# Altium project TG102LE_4G_A7682_240822.PrjPcb
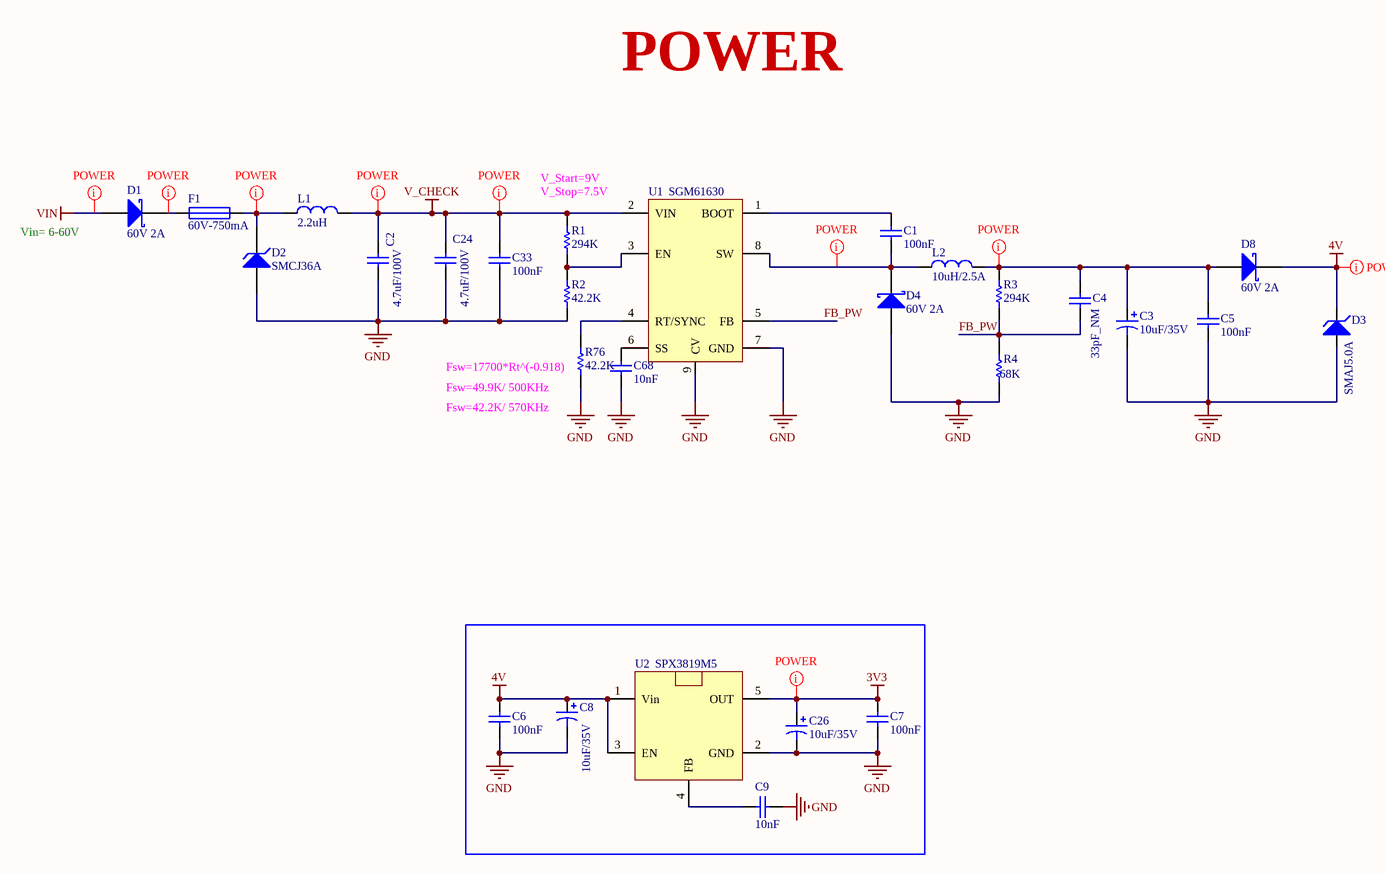
[diagram p0: 03 Power DC.SchDoc]
GlobalProjectName: TG102LE-4G
2 sheets, 34 parts. Net scope: flat (ports and power ports of the same name join across sheets).
Board file: TG102LE4G_A7682_240822.PcbDoc
Sheets:
  03 Power DC.SchDoc
  08 Motion.SchDoc

## Sheet 03 Power DC.SchDoc
size B

### Parts
C1  100nF  [0603 - C]
C2  4.7uF/100V  [1210 - C]
C3  10uF/35V  [CAP_ALUM_SMD_5054_TYPE_C]
C4  33pF_NM  [0603 - C]
C5  100nF  [0603 - C]
C6  100nF  [0603 - C]
C7  100nF  [0603 - C]
C8  10uF/35V  [CAP_ALUM_SMD_5054_TYPE_C]
C9  10nF  [0603 - C]
C24  4.7uF/100V  [1210 - C]
C26  10uF/35V  [CAP_ALUM_SMD_5054_TYPE_C]
C33  100nF  [0603 - C]
C68  10nF  [0603 - C]
D1  60V 2A  [SOD-123]
D2  SMCJ36A  [DIODE - SMC]
D3  SMAJ5.0A  [Diode - SMA]
D4  60V 2A  [SOD-123]
D8  60V 2A  [SOD-123]
F1  60V-750mA  [2016 - Fuse]
L1  2.2uH  [1210 - L]
L2  10uH/2.5A  [INDUCTOR-5D28]
R1  294K  [0603 - R]
R2  42.2K  [0603 - R]
R3  294K  [0603 - R]
R4  68K  [0603 - R]
R76  value 42.2K  [0603 - R]  (hidden comment: 49.9K)
U1  SGM61630  [SOIC8 - POWER]
U2  SPX3819M5  [SOT23-5]

### Nets
3V3: C7.2 C26.1 U2.5(OUT)
4V: C6.2 C8.1 D3.2(K) D8.2(K) U2.1(Vin) U2.3(EN)
GND: C2.1 C3.2 C5.1 C6.1 C7.1 C8.2 C9.2 C24.1 C26.2 C33.1 C68.1 D2.1(A) D3.1(A) D4.1(A) R2.1 R4.1 R76.1 U1.7(GND) U1.9(CV) U2.2(GND)
V_CHECK: C2.2 C24.2 C33.2 L1.2 R1.2 U1.2(VIN)
VIN: D1.1(A)
FB_PW: C4.1 R3.1 R4.2 U1.5(FB)
NetC1_1: C1.1 U1.1(BOOT)
NetC1_2: C1.2 D4.2(K) L2.1 U1.8(SW)
NetC3_1: C3.1 C4.2 C5.2 D8.1(A) L2.2 R3.2
NetC9_1: C9.1 U2.4(NC)
NetC68_2: C68.2 U1.6(SS)
NetD1_2: D1.2(K) F1.1
NetD2_2: D2.2(K) F1.2 L1.1
NetR1_1: R1.1 R2.2 U1.3(EN)
NetR76_2: R76.2 U1.4(RT/SYNC)

### Layout directives
net class POWER: 3V3, 4V, NetC1_2, NetC3_1, NetD1_2, NetD2_2, V_CHECK, VIN

### Notes on the sheet
- POWER
- (near D1) Vin= 6-60V
- V_Start=9V
- V_Stop=7.5V
- (near R76) Fsw=17700*Rt^(-0.918)
- (near R76) Fsw=49.9K/ 500KHz
- (near R76) Fsw=42.2K/ 570KHz

### Library data of the parts
C1 C5-C7 C33 = Cap 0603 100nF: CAP CER 100nF 50V C0G/NP0 0603 ±5%; MPN: CL10C104JB8NNNC; MFR: SAMSUNG; Company ID: VT_CAP_C0603 100nF; Voltage: 50V; Package: 0603; Value: 100nF; Size: C0603: 100nF
C2 C24 = Cap 1210 4.7uF: CAP CER 4.7UF 100V X5R 1210; MFR: Taiyo Yuden; MPN: HMK325BJ475KM-PE; Company ID: VT_CAP_C1210 4.7uF 100V; Size: C1210: 4.7uF/100V; Value: 4.7uF/100V
C3 = Cap Alu 10uF/35V: CAP ALUM 100UF 20% 6.3V SMD 5x5.4mm; MPN: UWT1V100MCL1GB; MFR: Nichicon; Company ID: VT_CAP_ALU 10uF 35V; Value: 10uF/35V
C4 = Cap 0603 33pF: CAP CER 33PF 50V C0G 0603; MFR: Yageo; MPN: AC0603FRNPO9BN330; Company ID: VT_CAP_C0603 33pF; Size: C0603: 33pF; Value: 33pF_NM
C8 C26 = Cap Alu 10uF/35V: CAP ALUM 10UF 20% 35V SMD 5x5.4mm; MPN: UWT1V100MCL1GB; MFR: Nichicon; Company ID: VT_CAP_ALU 10uF 35V; Value: 10uF/35V
C9 C68 = Cap 0603 10nF: CAP CER 10nF 50V C0G/NP0 0603; MPN: CL10C103JB8NNNC; MFR: SAMSUNG; Company ID: VT_CAP_C0603 10nF; Size: C0603: 10nF; Value: 10nF
D1 D4 D8 = Diode PMEG6020ER: DIODE SCHOTTKY 60V 2A SOD123W; MPN: PMEG6020ER,115; MFR: NXP; Company ID: VT_DIODE_PMEG6020ER
D2 = Diode SMCJ36A: TVS DIODE 36V 58.1V DO214AB; MFR: Vishay; MPN: SMCJ36A-E3/9AT; Company ID: VT_DIODE_ SMCJ36
D3 = Diode SMAJ5.0A: TVS DIODE 5VWM 9.2VC SMA; MFR: Littelfuse Inc.; Company ID: VT_DIODE_ SMAJ5.0A; MPN: SMAJ5.0A
F1 = Fuse 60V - 750mA: PTC RESET FUSE 60V 750MA 2016; MFR: Littelfuse Inc.; MPN: 2016L075/60MR; Company ID: VT_Fuse_60V - 750mA
L1 = Inductor 3225 2.2uH: FIXED IND 2.2UH 1.6A 76 MOHM SMD; MPN: LQH32PN2R2NN0; MFR: Murata; Company ID: VT_IND_3225 2.2uH; Value: 2.2uH; Size: L3225: 2.2uH; MPN2: SWPA3015S2R2NT
L2 = Inductor 10uH 2.5A: FIXED IND 10UH 2.5A 61.1MOHM SMD; MFR: Taiyo Yuden; MPN: NR6045T100M; Company ID: VT_IND_10uH/2.5A
R1 R3 = Res 0603 294K: RES SMD 294K OHM 1% 1/10W 0603; MFR: Yageo; MPN: RC0603FR-07294KL; Company ID: VT_RES_R0603 294K; Value: 294K
R2 R76 = Res 0603 42.2K: RES SMD 42K2 OHM 1% 1/10W 0603; MFR: Yageo; MPN: RC0603FR-0742K2L; Company ID: VT_RES_R0603 42K2; Size: R0603: 42K2
  R2: Value: 42.2K
R4 = Res 0603 68K: RES SMD 68K OHM 1% 1/10W 0603; MFR: Yageo; MPN: RC0603FR-0768KL; Company ID: VT_RES_R0603 68K; Size: R0603: 68K; Value: 68K
U1 = SGM61630: MPN: SGM61630AXPS8G/TR; MFR: SGMICRO; Company ID: VT_IC_SGM61630
U2 = SPX3819M5-L-3-3/TR: IC REG LINEAR 3.3V 500MA SOT23-5; MFR: MaxLinear; Company ID: VT_IC_SPX3819; MPN: SPX3819M5-L-3-3/TR

## Sheet 08 Motion.SchDoc
size A
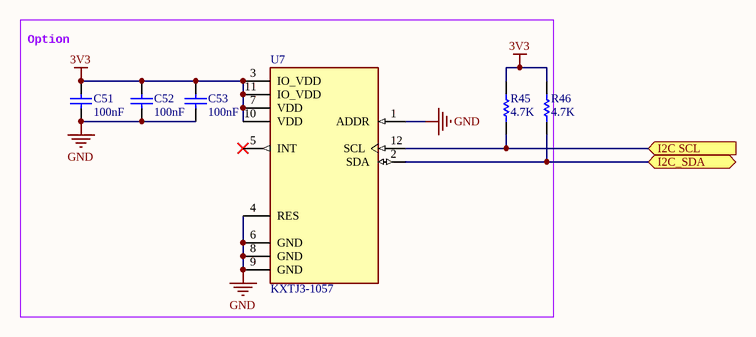
[diagram p1: 08 Motion.SchDoc]

### Parts
C51  100nF  [0603 - C]
C52  100nF  [0603 - C]
C53  100nF  [0603 - C]
R45  4.7K  [0603 - R]
R46  4.7K  [0603 - R]
U7  KXTJ3-1057  [KXTJ3-1057]

### Blocks framed on the sheet
Option: C51-C53 R45 R46 U7

### Ports
I2C SCL (in), I2C_SDA (bidir)

### Nets
3V3: C51.2 C52.2 C53.2 R45.2 R46.2 U7.3(IO_VDD) U7.7(VDD) U7.10(VDD) U7.11(IO_VDD)
GND: C51.1 C52.1 C53.1 U7.1(ADDR) U7.4(RES) U7.6(GND) U7.8(GND) U7.9(GND)
NetR45_1: R45.1 U7.12(SCL) ; port I2C SCL
NetR46_1: R46.1 U7.2(SDA) ; port I2C_SDA

Not connected (* = marked no-connect by the designer): U7 5(INT)*

### Library data of the parts
C51-C53 = Cap 0603 100nF: as C1 on sheet 03 Power DC; Voltage: 50V; Package: 0603; Size: C0603: 100nF; Value: 100nF
R45 R46 = Res 0603 4.7K: RES SMD 4.7K OHM 1% 1/10W 0603; MFR: Yageo; MPN: RC0603FR-074K7L; Company ID: VT_RES_R0603 4.7K; Size: R0603: 4.7K; Value: 4.7K
U7 = KXTJ3-1057: ACCELEROMETER 2-16G I2C 12LGA; MFR: Kionix Inc.; Company ID: VT_IC_KXTJ3-1057; MPN: KXTJ3-1057

## Nets that join several sheets
3V3: 03 Power DC (C7.2 C26.1 U2.5), 08 Motion (9 pins)
GND: 03 Power DC (20 pins), 08 Motion (8 pins)